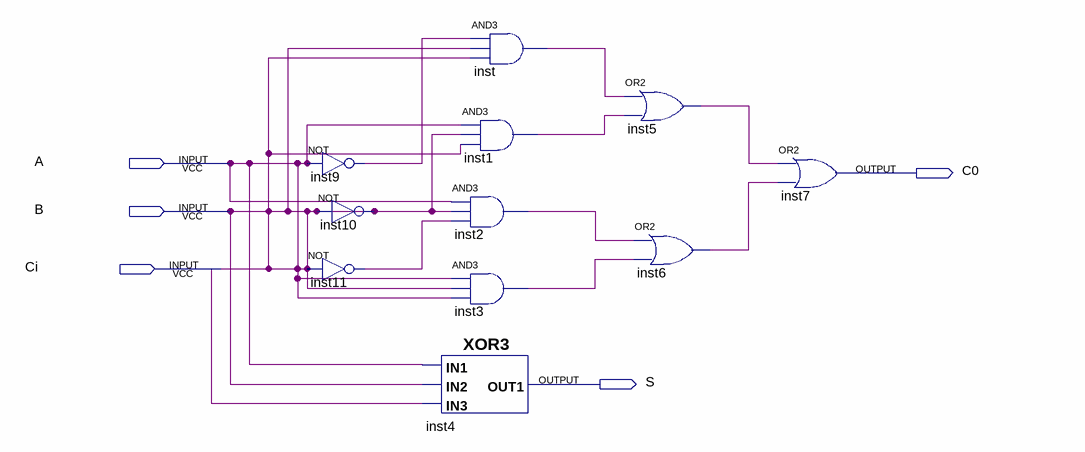
[diagram p0: schematic sheet]
// Quartus schematic full_adder.bdf as structural Verilog: 11 symbols, 5 pins
module full_adder (
  input  A,
  input  B,
  input  Ci,
  output C0,
  output S
);

  wire inst1_out, inst2_out, inst3_out, inst5_out, inst6_out, inst9_out, inst11_out, inst_out, undriven;

  not inst9 (inst9_out, A);
  not inst10 (A, A);
  not inst11 (inst11_out, A);
  and inst2 (inst2_out, A, A, inst11_out);
  and inst3 (inst3_out, A, A, A);
  XOR3 inst4 (.IN3(undriven), .IN1(A), .IN2(A));  // open: OUT1
  and inst (inst_out, inst9_out, A, A);
  and inst1 (inst1_out, A, A, A);
  or inst5 (inst5_out, inst_out, inst1_out);
  or inst6 (inst6_out, inst2_out, inst3_out);
  or inst7 (C0, inst5_out, inst6_out);

  assign B = A;
  assign Ci = A;
endmodule
